# Altium project LifeLine.PrjPcb (part 2 of 2)

## Sheet AD8232.SchDoc
size A3; SheetNumber: 2; SheetTotal: 2
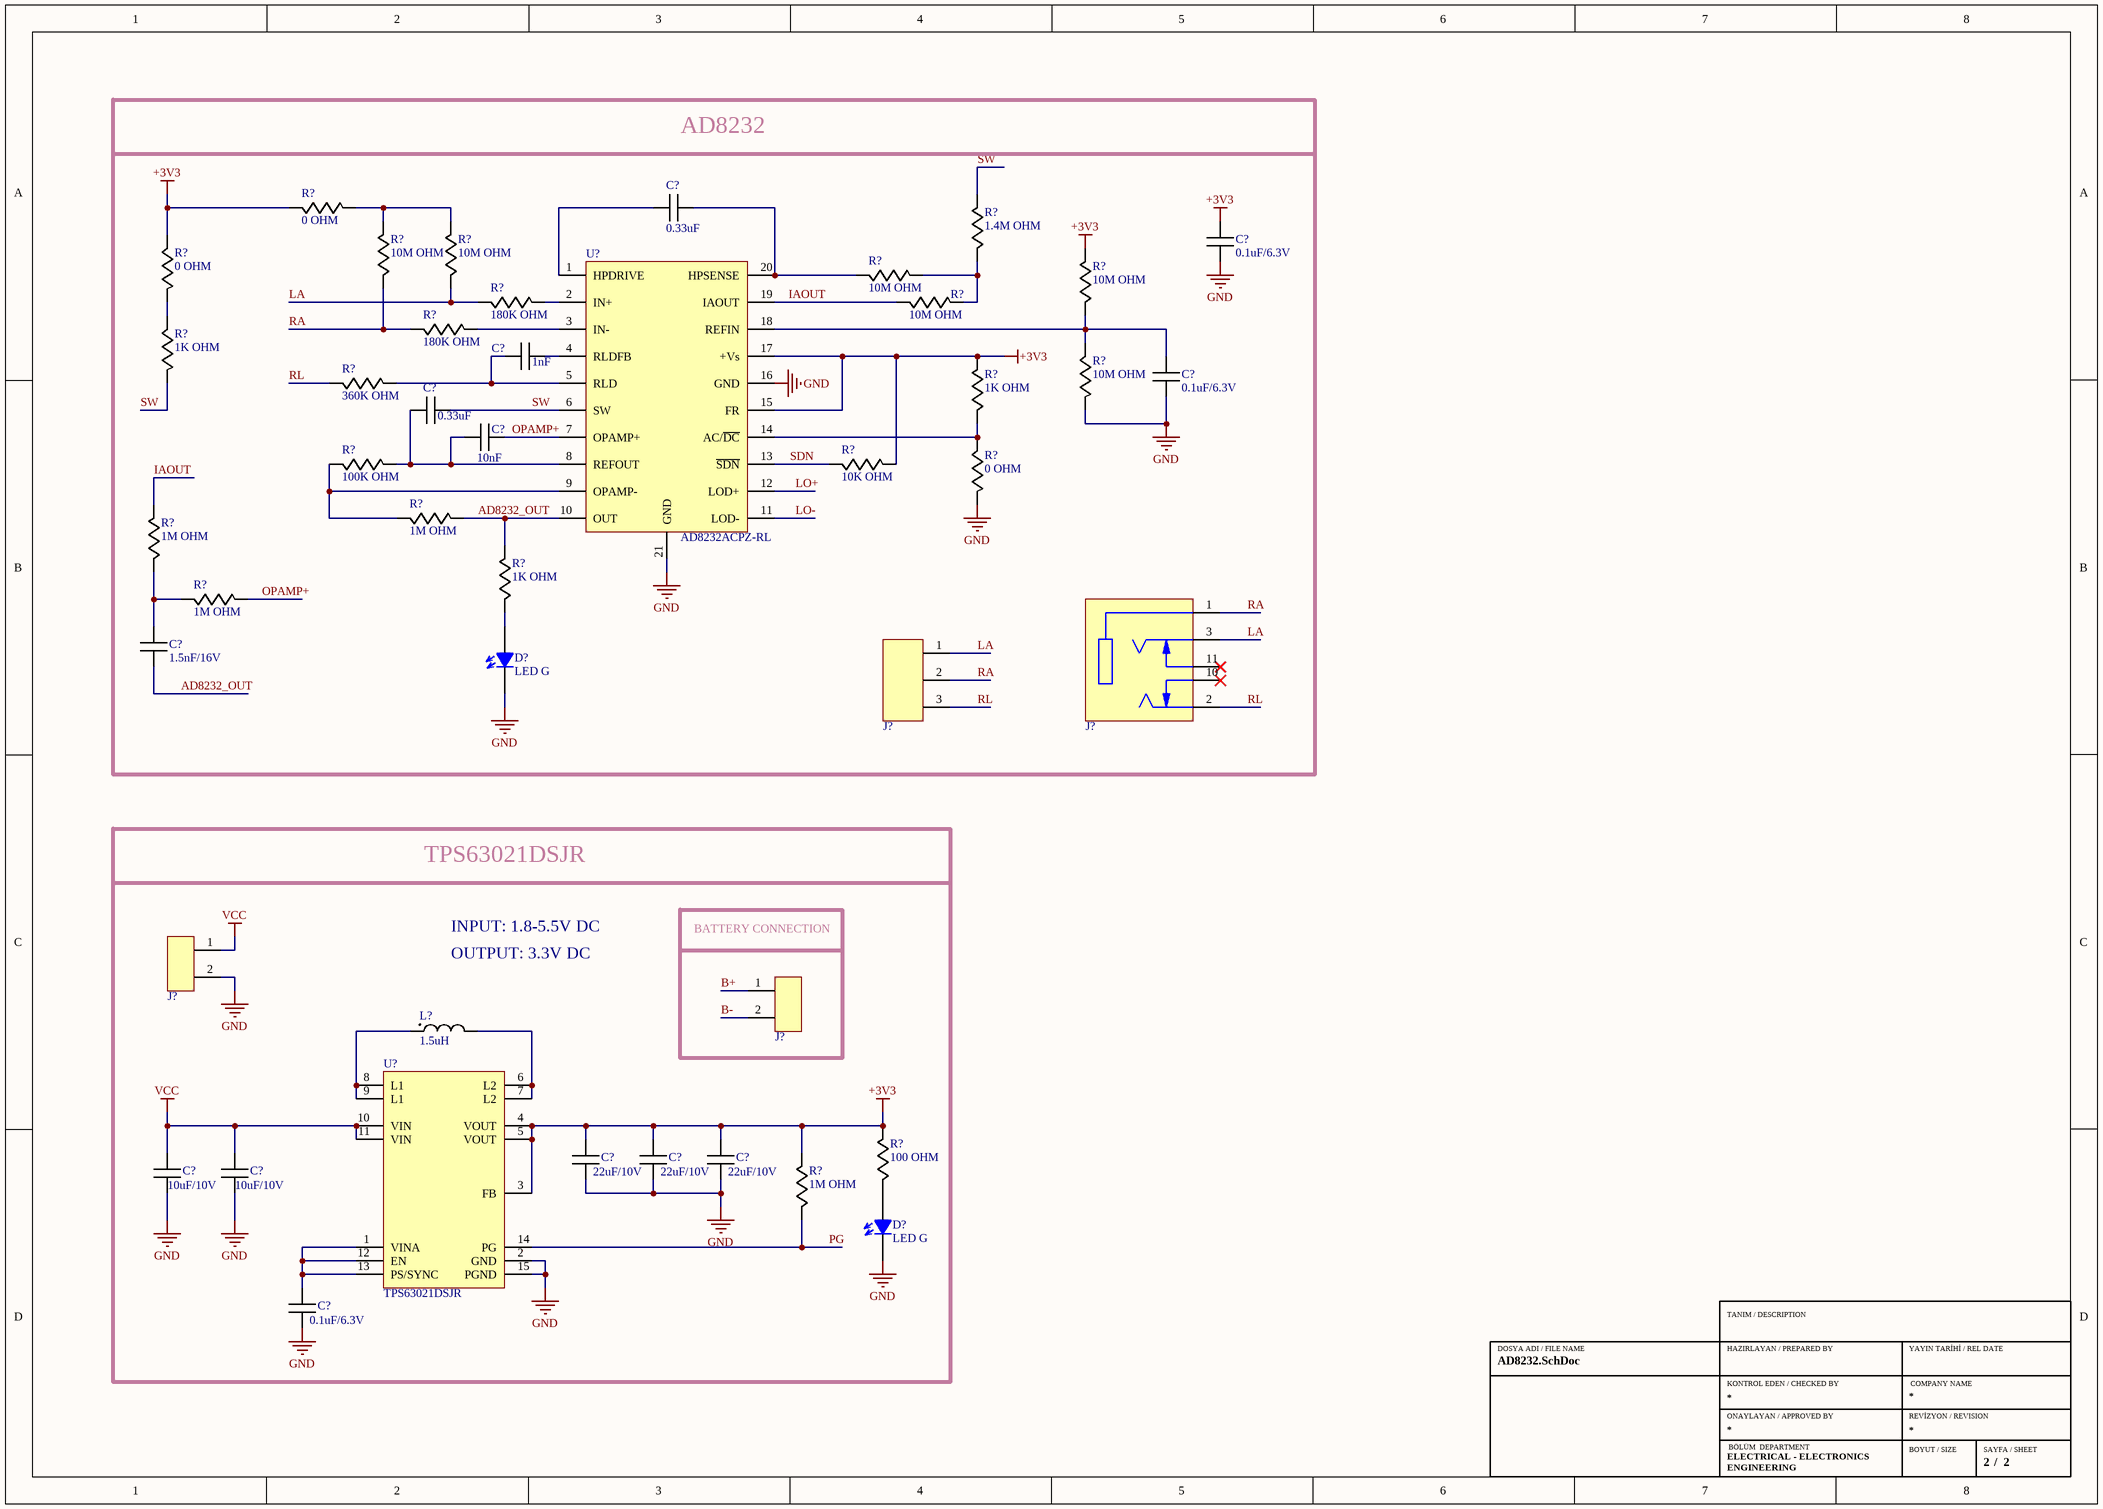
[diagram p1: AD8232.SchDoc]

### Parts
(Parts that share a designator on the sheet are numbered #1, #2 ... from top to bottom, then left to right.)
C?#17  0.33uF  [CAP_0603]
C?#18  0.1uF/6.3V  [CAP_0603]
C?#19  1nF  [CAP_0603]
C?#20  0.1uF/6.3V  [CAP_0603]
C?#21  0.33uF  [CAP_0603]
C?#22  10nF  [CAP_0603]
C?#23  1.5nF/16V  [CAP_0603]
C?#24  22uF/10V  [CAP_0603]
C?#25  22uF/10V  [CAP_0603]
C?#26  22uF/10V  [CAP_0603]
C?#27  10uF/10V  [CAP_0603]
C?#28  10uF/10V  [CAP_0603]
C?#29  0.1uF/6.3V  [CAP_0603]
D?#5  LED G  [LED_GREEN_0805]
D?#6  LED G  [LED_GREEN_0805]
J?#6  PPTC031LFBN-RC  [HEADER X3]  (value not drawn)
J?#7  AUDIO JACK, 3.5 MM, RT, 3 CONDUC  [SJ2-3593D]  (value not drawn)
J?#8  Header x2  [HEADER X2]  (value not drawn)
J?#9  BH-18650-PC  [1S BATTERY HOLDER]  (value not drawn)
L?  1.5uH  [IND_1616]
R?#15  0 OHM  [RES_0603]
R?#16  0 OHM  [RES_0603]
R?#17  1.4M OHM  [RES_0603]
R?#18  10M OHM  [RES_0603]
R?#19  10M OHM  [RES_0603]
R?#20  10M OHM  [RES_0603]
R?#21  180K OHM  [RES_0603]
R?#22  10M OHM  [RES_0603]
R?#23  1K OHM  [RES_0603]
R?#24  10M OHM  [RES_0603]
R?#25  180K OHM  [RES_0603]
R?#26  10M OHM  [RES_0603]
R?#27  360K OHM  [RES_0603]
R?#28  1K OHM  [RES_0603]
R?#29  0 OHM  [RES_0603]
R?#30  100K OHM  [RES_0603]
R?#31  10K OHM  [RES_0603]
R?#32  1M OHM  [RES_0603]
R?#33  1M OHM  [RES_0603]
R?#34  1M OHM  [RES_0603]
R?#35  1K OHM  [RES_0603]
R?#36  100 OHM  [RES 0805]
R?#37  1M OHM  [RES_0603]
U?#6  AD8232ACPZ-RL  [AD8232]
U?#7  TPS63021DSJR  [14-VFDFN]

### Blocks framed on the sheet
AD8232: C?#17-C?#23 D?#5 J?#6 J?#7 R?#15-R?#35 U?#6
TPS63021DSJR: C?#24-C?#29 D?#6 J?#8 L? R?#36 R?#37 U?#7
BATTERY CONNECTION: J?#9

### Nets
+3V3: C?#18.2 C?#24.2 C?#25.2 C?#26.2 R?#15.1 R?#16.1 R?#24.2 R?#28.2 R?#31.2 R?#36.2 R?#37.2 U?#6.15(FR) U?#6.17(+Vs) U?#7.3(FB) U?#7.4(VOUT) U?#7.5(VOUT)
GND: C?#18.1 C?#20.1 C?#24.1 C?#25.1 C?#26.1 C?#27.1 C?#28.1 C?#29.1 D?#5.1 D?#6.1 J?#8.2 R?#26.2 R?#29.2 U?#6.16(GND) U?#6.21(GND) U?#7.2(GND) U?#7.15(PGND)
VCC: C?#27.2 C?#28.2 J?#8.1 U?#7.10(VIN) U?#7.11(VIN)
AD8232_OUT: C?#23.1 R?#32.2 R?#35.2 U?#6.10(OUT)
B+: J?#9.1
B-: J?#9.2
IAOUT: R?#22.1 R?#33.2 U?#6.19(IAOUT)
LA: J?#6.1 J?#7.3(RING) R?#20.1 R?#21.1
LO+: U?#6.12(LOD+)
LO-: U?#6.11(LOD-)
OPAMP+: C?#22.2 R?#34.2 U?#6.7(OPAMP+)
PG: R?#37.1 U?#7.14(PG)
RA: J?#6.2 J?#7.1(SLEEVE) R?#19.1 R?#25.1
RL: J?#6.3 J?#7.2(TIP) R?#27.1
SDN: R?#31.1 U?#6.13(~{SDN})
SW: C?#21.2 R?#17.2 R?#23.2 U?#6.6(SW)
NetC?#17_1: C?#17.1 U?#6.1(HPDRIVE)
NetC?#17_2: C?#17.2 R?#18.1 U?#6.20(HPSENSE)
NetC?#19_1: C?#19.1 U?#6.4(RLDFB)
NetC?#19_2: C?#19.2 R?#27.2 U?#6.5(RLD)
NetC?#20_2: C?#20.2 R?#24.1 R?#26.1 U?#6.18(REFIN)
NetC?#21_1: C?#21.1 C?#22.1 R?#30.2 U?#6.8(REFOUT)
NetC?#23_2: C?#23.2 R?#33.1 R?#34.1
NetC?#29_2: C?#29.2 U?#7.1(VINA) U?#7.12(EN) U?#7.13(PS/SYNC)
NetD?#5_2: D?#5.2 R?#35.1
NetD?#6_2: D?#6.2 R?#36.1
NetL?_1: L?.1 U?#7.8(L1) U?#7.9(L1)
NetL?_2: L?.2 U?#7.6(L2) U?#7.7(L2)
NetR?#15_2: R?#15.2 R?#19.2 R?#20.2
NetR?#16_2: R?#16.2 R?#23.1
NetR?#17_1: R?#17.1 R?#18.2 R?#22.2
NetR?#21_2: R?#21.2 U?#6.2(IN+)
NetR?#25_2: R?#25.2 U?#6.3(IN-)
NetR?#28_1: R?#28.1 R?#29.1 U?#6.14(AC/~{DC})
NetR?#30_1: R?#30.1 R?#32.1 U?#6.9(OPAMP-)

Not connected (* = marked no-connect by the designer): J?#7 10(TIP_SWITCH)* 11(RING_SWITCH1)*

### Notes on the sheet
- INPUT: 1.8-5.5V DC
- OUTPUT: 3.3V DC
- TANIM / DESCRIPTION
- DOSYA ADI / FILE NAME
- HAZIRLAYAN / PREPARED BY
- KONTROL EDEN / CHECKED BY
- YAYIN TARİHİ / REL DATE
- COMPANY NAME
- ONAYLAYAN / APPROVED BY
- ELECTRICAL - ELECTRONICS
- BÖLÜM  DEPARTMENT
- BOYUT / SIZE
- REVİZYON / REVISION
- SAYFA / SHEET
- ENGINEERING
- /

### Library data of the parts
C?#17 C?#21 = CAP CER 0.33uF 0603 - L: Res Thick Film 0603 1M Ohm 5% 1/10W ±200ppm/°C Molded SMD SMD Paper T/R; Manufacturer: Vishay Dale; Manufacturer Part Number: CRCW06031M00JNEA; Resistance: 1MR; Power Rating: 100mW; Voltage Rating: 75V; Supplier 1: Arrow Electronics; RoHS: Yes; Category: Chip SMD Resistors; Stock 1: 960000; Pricing 1: 5000=0,0028 (USD); Case/Package: 0603; Number of Pins: 2; Weight: 7.1E-05oz; Case Code (Imperial): 0603; Case Code (Metric): 1608; Contact Plating: Tin; Size Code: 0603; Min Operating Temperature: -55°C; Max Operating Temperature: 155°C; Tolerance: 5%; Packaging: Tape and Reel; Package Quantity: 5000; Termination: SMD/SMT; Resistor Type: Thick Film; Number of Terminations: 2; Temperature Coefficient: 200ppm/°C; Max Power Dissipation: 100mW; Features: Automotive AEC-Q200; Series: CRCW; Construction: Rectangular; Resistance Tolerance: 5%; Length: 1.55mm; Width: 0.85mm; Height: 0.45mm; Depth: 0.85mm; Ratings: AEC-Q200; Radiation Hardening: No; Lead Free: 5697LeadFree; Military Standard: Not; RoHS Compliant: Yes; Reach SVHC Compliant: Unknown; ComponentLink1URL: https://datasheet.ciiva.com/2462/dcrcwe3-2462062.pdf?src-supplier=Digikey; ComponentLink1Description: https://datasheet.ciiva.com/2462/dcrcwe3-2462062.pdf?src-supplier=Digikey; ComponentLink2URL: https://datasheet.ciiva.com/2462/dcrcwe3-2462063.pdf?src-supplier=Digikey; ComponentLink2Description: https://datasheet.ciiva.com/2462/dcrcwe3-2462063.pdf?src-supplier=Digikey; ComponentLink3URL: https://datasheet.ciiva.com/2462/dcrcwe3-2462061.pdf?src-supplier=Digikey; ComponentLink3Description: https://datasheet.ciiva.com/2462/dcrcwe3-2462061.pdf?src-supplier=Digikey; ComponentLink4URL: https://datasheet.ciiva.com/3257/dcrcwe3-3257206.pdf?src-supplier=Avnet; ComponentLink4Description: https://datasheet.ciiva.com/3257/dcrcwe3-3257206.pdf?src-supplier=Avnet; ComponentLink5URL: https://datasheet.ciiva.com/16351/dcrcwe3-16351110.pdf?src-supplier=Future+Electronics; ComponentLink5Description: https://datasheet.ciiva.com/16351/dcrcwe3-16351110.pdf?src-supplier=Future+Electronics; Supplier Part Number 1: CRCW06031M00JNEA
C?#18 C?#20 = CAP CER 0.1uF 0603 - L: Capacitor, Ceramic, 100Nf, 6.3Vdc, 10-% Tol, 10+% Tol, X7r-Tc Code, -15, 15%-Tc Rohs Compliant: Yes; Manufacturer: KEMET; Manufacturer Part Number: C0603C104K9RACTU; Dielectric Material: 4241ConductorMaterial; Voltage Rating: 6.3V; Tolerance: 10%; Dielectric: X7R; Dissipation Factor: 5%; Supplier 1: Digikey; RoHS: Yes; Category: Ceramic Capacitors; Stock 1: 82215; Pricing 1: 1=0,11, 10=0,066, 100=0,0429, 1000=0,0305 (USD); Mount: Surface Mount; Case/Package: 0603; Case Code (Imperial): 0603; Case Code (Metric): 1608; Material: 4241ConductorMaterial; Min Operating Temperature: -55°C; Max Operating Temperature: 125°C; Capacitance: 100nF; Package Quantity: 4000; Packaging: Tape and Reel; Voltage Rating (DC): 6.3V; Termination: SMD/SMT; Series: C; Construction: Flat; Length: 1.6mm; Width: 0.8mm; Height: 0.8mm; Thickness: 0.034inch; Depth: 0.8mm; Radiation Hardening: No; RoHS Compliant: Yes; ComponentLink1URL: https://datasheet.ciiva.com/13371/kem-c1002-x7r-smd-357932-13371879.pdf?src-supplier=Mouser; ComponentLink1Description: https://datasheet.ciiva.com/13371/kem-c1002-x7r-smd-357932-13371879.pdf?src-supplier=Mouser; Supplier Part Number 1: 399-15351-1-ND
C?#19 = CAP CER 1nF 0603 - L: Cap Ceramic 0.001uF 16V X7R 10% Pad SMD 0603 Flexible Termination 125°C Automotive Medical T/R; Manufacturer: KEMET; Manufacturer Part Number: C0603X102K4RACAUTO; Dielectric Material: 4241ConductorMaterial; Dielectric: 1511DielectricType; Supplier 1: Mouser; RoHS: Yes; Category: Ceramic Capacitors; Stock 1: 6058; Pricing 1: 1=0,35, 10=0,21, 50=0,21, 100=0,138, 1000=0,1, 10000=0,073 (USD); Case/Package: 345Case; Capacitance: 1nF; Voltage Rating (DC): 16V; Supplier Part Number 1: 80-C0603X102K4RAUTO
C?#22 = CAP CER 10nF 0603 - L: Cap Ceramic 0.01uF 100V X7R 10% Pad SMD 0603 Flexible Termination 125°C Automotive Medical T/R; Manufacturer: KEMET; Manufacturer Part Number: C0603X103K1RACAUTO7411; Dielectric Material: 4241ConductorMaterial; Dielectric: 1511DielectricType; Supplier 1: Farnell; RoHS: Yes; Category: Capacitors; Pricing 1: 15000=0,071 (EUR); Case/Package: 345Case; Capacitance: 10nF; Voltage Rating (DC): 100V; Supplier Part Number 1: 4256824
C?#23 = CAP CER 1.5nF 0603 - L: Surface Mount Ceramic Multilayer Capacitor 0.0015uF 10% X7R 16V 0603 Paper T/R; Manufacturer: Yageo; Manufacturer Part Number: CC0603KRX7R7BB152; Material: 4241ConductorMaterial; Supplier 1: Mouser; RoHS: Yes; Category: Ceramic Capacitors; Stock 1: 19885; Pricing 1: 1=0,1, 10=0,029, 50=0,029, 100=0,017, 1000=0,011, 10000=0,007 (USD); ComponentLink1URL: https://datasheet.ciiva.com/13265/upy-gphc-x7r-6-3v-to-50v-8-12304-13265065.pdf?src-supplier=Mouser; ComponentLink1Description: https://datasheet.ciiva.com/13265/upy-gphc-x7r-6-3v-to-50v-8-12304-13265065.pdf?src-supplier=Mouser; Supplier Part Number 1: 603-CC603KRX7R7BB152
C?#24-C?#26 = CAP CER 22uF: Multilayer Ceramic Capacitor, 22 uF, 10 V, ï¿½ 20%, X5R, 0603 [1608 Metric]; Manufacturer: Murata; Manufacturer Part Number: GRM188R61A226ME15D; Capacitance: 22uF; Voltage Rating: 10V; Supplier 1: Digikey; RoHS: Yes; Category: Ceramic Capacitors; Stock 1: 1055825; Pricing 1: 1=0,17, 10=0,107, 100=0,056, 1000=0,0376 (USD); Mount: Surface Mount; Case/Package: 0603; Case Code (Metric): 1608; Case Code (Imperial): 0603; Material: Ceramic; Weight: 0.000222oz; Min Operating Temperature: -55°C; Max Operating Temperature: 85°C; Tolerance: 20%; Packaging: Cut Tape; Dielectric: X5R; Termination: SMD/SMT; Voltage Rating (DC): 10V; Package Quantity: 4000; Series: GRM; Length: 1.6mm; Width: 0.8mm; Height: 0.8mm; Thickness: 0.039inch; Reach SVHC Compliant: No; RoHS Compliant: Yes; Lead Free: 5697LeadFree; ComponentLink1URL: https://datasheet.ciiva.com/46444/1769893-46444975.pdf?src-supplier=Element14; ComponentLink1Description: https://datasheet.ciiva.com/46444/1769893-46444975.pdf?src-supplier=Element14; Supplier Part Number 1: 490-10476-1-ND
C?#27 C?#28 = CAP CER 10uF: Multilayer Ceramic Capacitor, 10 uF, 10 V, ï¿½ 20%, X5R, 0603 [1608 Metric]; Manufacturer: Murata; Manufacturer Part Number: GRM188R61A106ME69D; Capacitance: 10uF; Voltage Rating: 10V; Supplier 1: Digikey; RoHS: Yes; Category: Ceramic Capacitors; Stock 1: 92548; Pricing 1: 1=0,12, 10=0,068, 100=0,0409, 1000=0,02707 (USD); Mount: Surface Mount; Case/Package: 0603; Number of Pins: 2NUMBER; Case Code (Metric): 1608; Case Code (Imperial): 0603; Material: Ceramic; Weight: 0.000222oz; Min Operating Temperature: -55°C; Max Operating Temperature: 85°C; Packaging: Tape and Reel; Tolerance: 20%; Dielectric: X5R; Termination: SMD/SMT; Voltage Rating (DC): 10V; Package Quantity: 4000; Series: GRM; Length: 1.6mm; Width: 0.8mm; Height: 0.8mm; Thickness: 0.035inch; Lead Free: Lead Free; RoHS Compliant: Yes; Reach SVHC Compliant: Unknown; ComponentLink1URL: http://www.farnell.com/datasheets/1872210.pdf?src-supplier=Farnell; ComponentLink1Description: http://www.farnell.com/datasheets/1872210.pdf?src-supplier=Farnell; ComponentLink2URL: http://www.mouser.com/ds/2/281/c02e-2905.pdf?src-supplier=Mouser; ComponentLink2Description: http://www.mouser.com/ds/2/281/c02e-2905.pdf?src-supplier=Mouser; ComponentLink3URL: http://www.farnell.com/datasheets/1872210.pdf?src-supplier=Newark; ComponentLink3Description: http://www.farnell.com/datasheets/1872210.pdf?src-supplier=Newark; ComponentLink4URL: https://datasheet.octopart.com/GRM188R61A106ME69D-Murata-datasheet-22122223.pdf?src-supplier=Future+Electronics; ComponentLink4Description: https://datasheet.octopart.com/GRM188R61A106ME69D-Murata-datasheet-22122223.pdf?src-supplier=Future+Electronics; ComponentLink5URL: http://search.murata.co.jp/Ceramy/image/img/A01X/G101/ENG/GRM188R61A106ME69-01.pdf?src-supplier=Digikey; ComponentLink5Description: http://search.murata.co.jp/Ceramy/image/img/A01X/G101/ENG/GRM188R61A106ME69-01.pdf?src-supplier=Digikey; ComponentLink6URL: http://www.farnell.com/datasheets/2048014.pdf?src-supplier=Element14; ComponentLink6Description: http://www.farnell.com/datasheets/2048014.pdf?src-supplier=Element14; ComponentLink7URL: https://datasheet.octopart.com/GRM188R61A106ME69D-Murata-datasheet-62317187.pdf?src-supplier=Element14; ComponentLink7Description: https://datasheet.octopart.com/GRM188R61A106ME69D-Murata-datasheet-62317187.pdf?src-supplier=Element14; ComponentLink8URL: http://www.farnell.com/datasheets/1872210.pdf?src-supplier=Element14; ComponentLink8Description: http://www.farnell.com/datasheets/1872210.pdf?src-supplier=Element14; ComponentLink9URL: https://datasheet.octopart.com/GRM188R61A106ME69D-Murata-datasheet-165579666.pdf?src-supplier=TME; ComponentLink9Description: https://datasheet.octopart.com/GRM188R61A106ME69D-Murata-datasheet-165579666.pdf?src-supplier=TME; Supplier Part Number 1: 490-10475-1-ND
C?#29 = CAP CER 0.1uF: Capacitor, Ceramic, 100Nf, 6.3Vdc, 10-% Tol, 10+% Tol, X7r-Tc Code, -15, 15%-Tc Rohs Compliant: Yes; Manufacturer: KEMET; Manufacturer Part Number: C0603C104K9RACTU; Dielectric Material: 4241ConductorMaterial; Voltage Rating: 6.3V; Tolerance: 10%; Dielectric: X7R; Dissipation Factor: 5%; Supplier 1: Digikey; RoHS: Yes; Category: Ceramic Capacitors; Stock 1: 82215; Pricing 1: 1=0,11, 10=0,066, 100=0,0429, 1000=0,0305 (USD); Mount: Surface Mount; Case/Package: 0603; Case Code (Imperial): 0603; Case Code (Metric): 1608; Material: 4241ConductorMaterial; Min Operating Temperature: -55°C; Max Operating Temperature: 125°C; Capacitance: 100nF; Package Quantity: 4000; Packaging: Tape and Reel; Voltage Rating (DC): 6.3V; Termination: SMD/SMT; Series: C; Construction: Flat; Length: 1.6mm; Width: 0.8mm; Height: 0.8mm; Thickness: 0.034inch; Depth: 0.8mm; Radiation Hardening: No; RoHS Compliant: Yes; ComponentLink1URL: https://datasheet.ciiva.com/13371/kem-c1002-x7r-smd-357932-13371879.pdf?src-supplier=Mouser; ComponentLink1Description: https://datasheet.ciiva.com/13371/kem-c1002-x7r-smd-357932-13371879.pdf?src-supplier=Mouser; Supplier Part Number 1: 399-15351-1-ND
D?#5 D?#6 = LED GREEN 0805: XL-2012SYGC / Green 570nm LED Indication - Discrete 2.1V 0805 (2012 Metric)
J?#6 = HEADER x3 - L: Female, 3C, Straight, .100"CC; 3.20mm Tail, No Mt. 100u" Tin; PBT, Phos Bronze, 105 C; Manufacturer: Sullins; Supplier 1: Future Electronics; Manufacturer Part Number: PPTC031LFBN-RC; RoHS: Yes; Category: Connectors; Pricing 1: 1000=0,179, 2000=0,176, 3000=0,175, 5000=0,173, 10000=0,17 (USD); ComponentLink1URL: https://media.digikey.com/pdf/Data%20Sheets/Sullins%20PDFs/Female_Headers.100_DS.pdf?src-supplier=Digikey; ComponentLink1Description: https://media.digikey.com/pdf/Data%20Sheets/Sullins%20PDFs/Female_Headers.100_DS.pdf?src-supplier=Digikey; ComponentLink2URL: https://datasheet.octopart.com/PPTC031LFBN-RC-Sullins-datasheet-41308905.pdf?src-supplier=Future+Electronics; ComponentLink2Description: https://datasheet.octopart.com/PPTC031LFBN-RC-Sullins-datasheet-41308905.pdf?src-supplier=Future+Electronics; ComponentLink3URL: http://www.sullinscorp.com/catalogs/78_Page80-81_HEADER_.100_2.54mm_FEMALE.pdf?src-supplier=Future+Electronics; ComponentLink3Description: http://www.sullinscorp.com/catalogs/78_Page80-81_HEADER_.100_2.54mm_FEMALE.pdf?src-supplier=Future+Electronics; Supplier Part Number 1: 2482834
J?#7 = SJ2-3593D: 3.5 mm, Stereo, Right Angle, Surface Mount (SMT), Audio Jack Connector; Manufacturer: Same Sky; Manufacturer Part Number: SJ2-3593D-SMT-TR; Body Color: Black; Gender: Female; Shielding: Unshielded; Current Rating: 1A; Number of Conductors: 3; Voltage Rating: 12V; Supplier 1: Mouser; RoHS: Yes; Category: Audio / Video Connectors; Stock 1: 1143; Pricing 1: 1=1,16, 10=0,985, 50=0,879, 100=0,837, 1000=0,73, 10000=0,644 (USD); Mount: Surface Mount; Contact Plating: Silver; Contact Material: Brass; Housing Material: Nylon; Min Operating Temperature: -25°C; Max Operating Temperature: 85°C; Series: SJ2; Termination: Solder; ComponentLink1URL: https://www.cuidevices.com/product/resource/digikeypdf/sj2-359x-smt.pdf?src-supplier=Digikey; ComponentLink1Description: https://www.cuidevices.com/product/resource/digikeypdf/sj2-359x-smt.pdf?src-supplier=Digikey; ComponentLink2URL: https://datasheet.octopart.com/SJ2-3593D-SMT-TR-CUI-Devices-datasheet-175926068.pdf?src-supplier=Electro+Sonic; ComponentLink2Description: https://datasheet.octopart.com/SJ2-3593D-SMT-TR-CUI-Devices-datasheet-175926068.pdf?src-supplier=Electro+Sonic; ComponentLink3URL: https://datasheet.octopart.com/SJ2-3593D-SMT-TR-CUI-Devices-datasheet-140598664.pdf?src-supplier=Master+Electronics; ComponentLink3Description: https://datasheet.octopart.com/SJ2-3593D-SMT-TR-CUI-Devices-datasheet-140598664.pdf?src-supplier=Master+Electronics; Supplier Part Number 1: 490-SJ2-3593D-SMT-TR
J?#9 = 1S BATTERY HOLDER: Battery Holder (Open) 18650 1 Cell PC Pin; ComponentLink1Description: purchasing; ComponentLink1URL: https://www.digikey.com/en/products/detail/mpd-memory-protection-devices/BH-18650-PC/3029216
L? = IND 1.5uH: Inductor Power Shielded Wirewound 1.5uH 20% 100KHz 9.1A 15.8mOhm DCR 1515 Automotive Embossed Plastic T/R; Manufacturer: Coilcraft; Manufacturer Part Number: XFL4020-152MEC; Series Resistance: 15.8mR; Supplier 1: Mouser; RoHS: Yes; Category: Fixed Inductors; Stock 1: 11355; Pricing 1: 1=2,68, 10=2,68, 50=2,68, 100=2,68, 1000=1,01, 10000=1,01 (USD); ComponentLink1URL: https://datasheet.ciiva.com/13168/xfl4020-13168080.pdf?src-supplier=Mouser; ComponentLink1Description: https://datasheet.ciiva.com/13168/xfl4020-13168080.pdf?src-supplier=Mouser; ComponentLink2URL: https://datasheet.ciiva.com/22679/1682010-22679275.pdf?src-supplier=Element14; ComponentLink2Description: https://datasheet.ciiva.com/22679/1682010-22679275.pdf?src-supplier=Element14; ComponentLink3URL: https://datasheet.ciiva.com/22679/1682010-22679276.pdf?src-supplier=Element14; ComponentLink3Description: https://datasheet.ciiva.com/22679/1682010-22679276.pdf?src-supplier=Element14; Supplier Part Number 1: 994-XFL4020-152MEC
R?#15 R?#16 R?#29 = RES 0 OHM 0603 - L: Zero Ohm Resistor, Jumper, 0603 [1608 Metric], Thick Film, 100 mW, 2 A, Surface Mount Device; Manufacturer: Vishay Semiconductors; Manufacturer Part Number: RCA06030000ZSEA; Voltage Rating (DC): 75V; Temperature Coefficient: 100ppm/°C; Supplier 1: Arrow Electronics; RoHS: Yes; Category: Chip SMD Resistors; Stock 1: 1488; Pricing 1: 1=0,0364, 10=0,0107, 25=0,0106, 100=0,0105, 250=0,0104, 500=0,0103 (USD); Lead Free: 5697LeadFree; ComponentLink1URL: https://datasheet.ciiva.com/8901/rcae3-8901867.pdf?src-supplier=Avnet; ComponentLink1Description: https://datasheet.ciiva.com/8901/rcae3-8901867.pdf?src-supplier=Avnet; ComponentLink2URL: https://datasheet.ciiva.com/16480/rcae3-16480902.pdf?src-supplier=Future+Electronics; ComponentLink2Description: https://datasheet.ciiva.com/16480/rcae3-16480902.pdf?src-supplier=Future+Electronics; Supplier Part Number 1: RCA06030000ZSEA
R?#17 = RES 1.4M OHM 0603 - L: Res Thick Film 0603 1.4M Ohm 1% 0.1W(1/10W) ±100ppm/C Pad SMD T/R Automotive AEC-Q200; Manufacturer: Vishay; Manufacturer Part Number: CRCW06031M40FKEA; Voltage Rating (DC): 75V; Supplier 1: Mouser; RoHS: Yes; Category: Chip SMD Resistors; Stock 1: 16256; Pricing 1: 1=0,1, 10=0,028, 50=0,028, 100=0,015, 1000=0,008, 10000=0,004 (USD); Lead Free: 5697LeadFree; ComponentLink1URL: https://datasheet.ciiva.com/16785/70201119-16785253.pdf?src-supplier=Allied+Electronics; ComponentLink1Description: https://datasheet.ciiva.com/16785/70201119-16785253.pdf?src-supplier=Allied+Electronics; ComponentLink2URL: https://datasheet.ciiva.com/16215/dcrcwe3-16215401.pdf?src-supplier=Future+Electronics; ComponentLink2Description: https://datasheet.ciiva.com/16215/dcrcwe3-16215401.pdf?src-supplier=Future+Electronics; ComponentLink3URL: https://datasheet.ciiva.com/22702/1697337-22702714.pdf?src-supplier=Element14; ComponentLink3Description: https://datasheet.ciiva.com/22702/1697337-22702714.pdf?src-supplier=Element14; ComponentLink4URL: https://datasheet.ciiva.com/22870/70201119-22870815.pdf?src-supplier=Allied+Electronics; ComponentLink4Description: https://datasheet.ciiva.com/22870/70201119-22870815.pdf?src-supplier=Allied+Electronics; ComponentLink5URL: https://datasheet.ciiva.com/5541/dcrcwe3-109170-5541158.pdf?src-supplier=Mouser; ComponentLink5Description: https://datasheet.ciiva.com/5541/dcrcwe3-109170-5541158.pdf?src-supplier=Mouser; ComponentLink6URL: https://datasheet.ciiva.com/2466/dcrcwe3-2466344.pdf?src-supplier=Digikey; ComponentLink6Description: https://datasheet.ciiva.com/2466/dcrcwe3-2466344.pdf?src-supplier=Digikey; ComponentLink7URL: https://datasheet.ciiva.com/2466/dcrcwe3-2466345.pdf?src-supplier=Digikey; ComponentLink7Description: https://datasheet.ciiva.com/2466/dcrcwe3-2466345.pdf?src-supplier=Digikey; ComponentLink8URL: https://datasheet.ciiva.com/2466/dcrcwe3-2466346.pdf?src-supplier=Digikey; ComponentLink8Description: https://datasheet.ciiva.com/2466/dcrcwe3-2466346.pdf?src-supplier=Digikey; ComponentLink9URL: https://datasheet.ciiva.com/9102/dcrcwe3-9102326.pdf?src-supplier=Avnet; ComponentLink9Description: https://datasheet.ciiva.com/9102/dcrcwe3-9102326.pdf?src-supplier=Avnet; ComponentLink10URL: https://datasheet.ciiva.com/7670/1697337-7670542.pdf?src-supplier=Element14; ComponentLink10Description: https://datasheet.ciiva.com/7670/1697337-7670542.pdf?src-supplier=Element14; ComponentLink11URL: https://datasheet.ciiva.com/7670/1697337-7670543.pdf?src-supplier=Element14; ComponentLink11Description: https://datasheet.ciiva.com/7670/1697337-7670543.pdf?src-supplier=Element14; Supplier Part Number 1: 71-CRCW06031M40FKEA
R?#18-R?#20 R?#22 R?#24 R?#26 = RES 10M OHM 0603 - L: SMD Chip Resistor, 10 MOhm, ± 5%, 250 mW, 0603 [1608 Metric], Thick Film, Anti-Surge; Manufacturer: Vishay Dale; Manufacturer Part Number: RCS060310M0JNEA; Resistance: 10MR; Max Power Dissipation: 250mW; Temperature Coefficient: 200ppm/°C; Supplier 1: Mouser; RoHS: Yes; Category: Chip SMD Resistors; Stock 1: 7358; Pricing 1: 1=0,14, 10=0,044, 50=0,044, 100=0,038, 1000=0,024, 10000=0,015 (USD); Case/Package: 0603; Case Code (Metric): 1608; Case Code (Imperial): 0603; Min Operating Temperature: -55°C; Max Operating Temperature: 155°C; Packaging: Cut Tape; Number of Terminations: 2; Tolerance: 5%; Features: Automotive AEC-Q200; Series: RCS; Length: 0.061inch; Width: 0.033inch; Height: 0.02inch; Ratings: AEC-Q200; ComponentLink1URL: http://www.vishay.com/docs/20065/rcse3.pdf?src-supplier=Digikey; ComponentLink1Description: http://www.vishay.com/docs/20065/rcse3.pdf?src-supplier=Digikey; Supplier Part Number 1: 71-RCS060310M0JNEA
R?#21 R?#25 = RES 180K OHM 0603 - L: Thick Film Resistors 1/10watt 180Kohms 5%; Manufacturer: KOA Speer; Manufacturer Part Number: RK73B1JTTD184J; Resistance: 180kR; Power Rating: 100mW; Voltage Rating: 50V; Temperature Coefficient: 200ppm/°C; Supplier 1: Mouser; RoHS: Yes; Category: Chip SMD Resistors; Stock 1: 68862; Pricing 1: 1=0,1, 10=0,011, 50=0,011, 100=0,009, 1000=0,005, 10000=0,002 (USD); Case/Package: 0603; Number of Pins: 2; Case Code (Imperial): 0603; Case Code (Metric): 1608; Min Operating Temperature: -55°C; Max Operating Temperature: 155°C; Tolerance: 5%; Packaging: Tape and Reel; Package Quantity: 5000; Resistor Type: Thick Film; Termination: SMD/SMT; Voltage Rating (DC): 50V; Series: RK73B; Construction: Rectangular; Technology: THICK FILM; Resistance Tolerance: 5%; Length: 1.6mm; Width: 0.8mm; Height: 0.45mm; Depth: 0.8mm; Military Standard: Not; Lead Free: Lead Free; RoHS Compliant: Yes; ComponentLink1URL: https://datasheet.ciiva.com/26893/getdatasheetpartid-447064-26893322.pdf?src-supplier=Verical; ComponentLink1Description: https://datasheet.ciiva.com/26893/getdatasheetpartid-447064-26893322.pdf?src-supplier=Verical; ComponentLink2URL: https://datasheet.ciiva.com/7763/548635-7763053.pdf?src-supplier=Element14; ComponentLink2Description: https://datasheet.ciiva.com/7763/548635-7763053.pdf?src-supplier=Element14; Supplier Part Number 1: 660-RK73B1JTTD184J
R?#23 R?#28 R?#35 = RES 1K OHM 0603 - L: Res Thick Film 0603 1K Ohm 5% 0.25W(1/4W) ±200ppm/°C Pad SMD T/R Automotive AEC-Q200; Manufacturer: Rohm; Manufacturer Part Number: ESR03EZPJ102; Resistance: 1kR; Max Power Dissipation: 250mW; Voltage Rating: 150V; Supplier 1: Mouser; RoHS: Yes; Category: Chip SMD Resistors; Stock 1: 16160; Pricing 1: 1=0,14, 10=0,043, 50=0,043, 100=0,037, 1000=0,023, 10000=0,015 (USD); Case/Package: 0603; Case Code (Metric): 1608; Case Code (Imperial): 0603; Min Operating Temperature: -55°C; Max Operating Temperature: 155°C; Tolerance: 5%; Packaging: Cut Tape; Number of Terminations: 2; Temperature Coefficient: 200ppm/°C; Features: Automotive AEC-Q200; Series: ESR; Voltage Rating (DC): 150V; Ratings: AEC-Q200; Lead Free: Lead Free; RoHS Compliant: Yes; ComponentLink1URL: https://datasheet.ciiva.com/2469/esr-2469604.pdf?src-supplier=Digikey; ComponentLink1Description: https://datasheet.ciiva.com/2469/esr-2469604.pdf?src-supplier=Digikey; ComponentLink2URL: https://datasheet.ciiva.com/2469/esr-2469605.pdf?src-supplier=Digikey; ComponentLink2Description: https://datasheet.ciiva.com/2469/esr-2469605.pdf?src-supplier=Digikey; ComponentLink3URL: https://datasheet.ciiva.com/2469/esr-2469603.pdf?src-supplier=Digikey; ComponentLink3Description: https://datasheet.ciiva.com/2469/esr-2469603.pdf?src-supplier=Digikey; Supplier Part Number 1: 755-ESR03EZPJ102
R?#27 = RES 360K OHM 0603 - L: Res Thick Film 0603 360K Ohm 1% 0.1W(1/10W) ±100ppm/C Pad SMD T/R; Manufacturer: Yageo; Manufacturer Part Number: RC0603FR-07360KL; Voltage Rating (DC): 50V; Supplier 1: Future Electronics; RoHS: Yes; Category: Chip SMD Resistors; Stock 1: 145000; Pricing 1: 5000=0,0009, 50000=0,0009, 150000=0,0009, 625000=0,0008, 1500000=0,0008 (USD); Lead Free: 5697LeadFree; ComponentLink1URL: https://datasheet.ciiva.com/11809/0900766b80c66297-11809321.pdf?src-supplier=Rs; ComponentLink1Description: https://datasheet.ciiva.com/11809/0900766b80c66297-11809321.pdf?src-supplier=Rs; ComponentLink2URL: https://datasheet.ciiva.com/12557/rc0603-272842-12557861.pdf?src-supplier=Mouser; ComponentLink2Description: https://datasheet.ciiva.com/12557/rc0603-272842-12557861.pdf?src-supplier=Mouser; ComponentLink3URL: https://datasheet.ciiva.com/2454/pyu-r-int-thick-7-2454222.pdf?src-supplier=Digikey; ComponentLink3Description: https://datasheet.ciiva.com/2454/pyu-r-int-thick-7-2454222.pdf?src-supplier=Digikey; ComponentLink4URL: https://datasheet.ciiva.com/2454/pyu-r-int-thick-7-2454223.pdf?src-supplier=Digikey; ComponentLink4Description: https://datasheet.ciiva.com/2454/pyu-r-int-thick-7-2454223.pdf?src-supplier=Digikey; ComponentLink5URL: https://datasheet.ciiva.com/2454/pyu-r-int-thick-7-2454224.pdf?src-supplier=Digikey; ComponentLink5Description: https://datasheet.ciiva.com/2454/pyu-r-int-thick-7-2454224.pdf?src-supplier=Digikey; Supplier Part Number 1: 4595138
R?#30 = RES 100K OHM 0603 - L: Res Thick Film 0603 100K Ohm 5% 1/10W ±200ppm/°C Molded SMD Paper T/R; Manufacturer: Stackpole Electronics; Manufacturer Part Number: RMCF0603JT100K; Voltage Rating: 75V; Supplier 1: Avnet; RoHS: Yes; Category: Chip SMD Resistors; Stock 1: 15000; Pricing 1: 5000=0,00122, 10000=0,00121, 20000=0,00119, 30000=0,00117, 40000=0,00115 (USD); ComponentLink1URL: https://datasheet.ciiva.com/15193/getdatasheetpartid-359906-15193499.pdf?src-supplier=Verical; ComponentLink1Description: https://datasheet.ciiva.com/15193/getdatasheetpartid-359906-15193499.pdf?src-supplier=Verical; Supplier Part Number 1: RMCF0603JT100K
R?#31 = RES 10K OHM 0603: SMD Chip Resistor, 10 kOhm, ï¿½ 1%, 100 mW, 0603 [1608 Metric], Thick Film, General Purpose; Manufacturer: Yageo; Manufacturer Part Number: RC0603FR-0710KL; Temperature Coefficient: 100ppm/°C; Voltage Rating (DC): 50V; Power Rating: 100mW; Voltage Rating: 75V; Resistance: 10kR; Supplier 1: Digi-Key; RoHS: Yes; Category: Chip SMD Resistors; Stock 1: 43901522; Pricing 1: 1=0,10000, 10=0,02200, 100=0,00890, 1000=0,00402, 2500=0,00349 (USD); Case/Package: 0603; Number of Pins: 2; Case Code (Imperial): 0603; Case Code (Metric): 1608; Weight: 7.1E-05oz; Size Code: 0603; Min Operating Temperature: -55°C; Max Operating Temperature: 155°C; Tolerance: 1%; Resistor Type: Thick Film; Packaging: Tape and Reel; Termination: SMD/SMT; Features: Moisture Resistant; Series: RC; Max Power Dissipation: 100mW; Number of Terminations: 2; Resistance Tolerance: 1%; Construction: Rectangular; Length: 1.6mm; Width: 0.8mm; Height: 0.45mm; Depth: 0.8mm; Lead Pitch: 0.3mm; REACH SVHC: Unknown; Lead Free: Lead Free; Military Standard: Not; RoHS Compliant: Yes; ComponentLink1URL: https://datasheet.ciiva.com/7660/38590-7660789.pdf?src-supplier=Element14; ComponentLink1Description: https://datasheet.ciiva.com/7660/38590-7660789.pdf?src-supplier=Element14; ComponentLink2URL: https://datasheet.ciiva.com/7983/443971-7983596.pdf?src-supplier=Element14; ComponentLink2Description: https://datasheet.ciiva.com/7983/443971-7983596.pdf?src-supplier=Element14; ComponentLink3URL: https://datasheet.ciiva.com/22747/443971-22747519.pdf?src-supplier=Element14; ComponentLink3Description: https://datasheet.ciiva.com/22747/443971-22747519.pdf?src-supplier=Element14; ComponentLink4URL: https://datasheet.ciiva.com/46440/1868787-46440891.pdf?src-supplier=Element14; ComponentLink4Description: https://datasheet.ciiva.com/46440/1868787-46440891.pdf?src-supplier=Element14; ComponentLink5URL: https://datasheet.ciiva.com/7746/1738695-7746239.pdf?src-supplier=Element14; ComponentLink5Description: https://datasheet.ciiva.com/7746/1738695-7746239.pdf?src-supplier=Element14; ComponentLink6URL: https://datasheet.ciiva.com/15189/getdatasheetpartid-409289-15189591.pdf?src-supplier=Verical; ComponentLink6Description: https://datasheet.ciiva.com/15189/getdatasheetpartid-409289-15189591.pdf?src-supplier=Verical; Supplier Part Number 1: 311-10.0KHRCT-ND; Supplier 2: Digikey; Stock 2: 3432908; Pricing 2: 1=0,1, 10=0,009, 100=0,0071, 1000=0,00612, 2500=0,00461 (USD); Reach SVHC Compliant: No; Supplier Part Number 2: 311-10.0KHRDKR-ND
R?#32-R?#34 = RES 1M OHM 0603 - L: Res Thick Film 0603 1M Ohm 5% 1/10W ±200ppm/°C Molded SMD SMD Paper T/R; Manufacturer: Vishay Dale; Manufacturer Part Number: CRCW06031M00JNEA; Resistance: 1MR; Power Rating: 100mW; Voltage Rating: 75V; Supplier 1: Arrow Electronics; RoHS: Yes; Category: Chip SMD Resistors; Stock 1: 960000; Pricing 1: 5000=0,0028 (USD); Case/Package: 0603; Number of Pins: 2; Weight: 7.1E-05oz; Case Code (Imperial): 0603; Case Code (Metric): 1608; Contact Plating: Tin; Size Code: 0603; Min Operating Temperature: -55°C; Max Operating Temperature: 155°C; Tolerance: 5%; Packaging: Tape and Reel; Package Quantity: 5000; Termination: SMD/SMT; Resistor Type: Thick Film; Number of Terminations: 2; Temperature Coefficient: 200ppm/°C; Max Power Dissipation: 100mW; Features: Automotive AEC-Q200; Series: CRCW; Construction: Rectangular; Resistance Tolerance: 5%; Length: 1.55mm; Width: 0.85mm; Height: 0.45mm; Depth: 0.85mm; Ratings: AEC-Q200; Radiation Hardening: No; Lead Free: 5697LeadFree; Military Standard: Not; RoHS Compliant: Yes; Reach SVHC Compliant: Unknown; ComponentLink1URL: https://datasheet.ciiva.com/2462/dcrcwe3-2462062.pdf?src-supplier=Digikey; ComponentLink1Description: https://datasheet.ciiva.com/2462/dcrcwe3-2462062.pdf?src-supplier=Digikey; ComponentLink2URL: https://datasheet.ciiva.com/2462/dcrcwe3-2462063.pdf?src-supplier=Digikey; ComponentLink2Description: https://datasheet.ciiva.com/2462/dcrcwe3-2462063.pdf?src-supplier=Digikey; ComponentLink3URL: https://datasheet.ciiva.com/2462/dcrcwe3-2462061.pdf?src-supplier=Digikey; ComponentLink3Description: https://datasheet.ciiva.com/2462/dcrcwe3-2462061.pdf?src-supplier=Digikey; ComponentLink4URL: https://datasheet.ciiva.com/3257/dcrcwe3-3257206.pdf?src-supplier=Avnet; ComponentLink4Description: https://datasheet.ciiva.com/3257/dcrcwe3-3257206.pdf?src-supplier=Avnet; ComponentLink5URL: https://datasheet.ciiva.com/16351/dcrcwe3-16351110.pdf?src-supplier=Future+Electronics; ComponentLink5Description: https://datasheet.ciiva.com/16351/dcrcwe3-16351110.pdf?src-supplier=Future+Electronics; Supplier Part Number 1: CRCW06031M00JNEA
R?#36 = RES 100 OHM 0805: Res Thick Film 0805 100 Ohm 1% 0.5W(1/2W) +/-100ppm/C Pad SMD Automotive T/R; Manufacturer: Vishay Dale; Manufacturer Part Number: CRCW0805100RFKEAHP; Voltage Rating (DC): 150V; Supplier 1: Mouser; RoHS: Yes; Category: Chip SMD Resistors; Stock 1: 108057; Pricing 1: 1=0,18, 10=0,061, 50=0,061, 100=0,052, 1000=0,033, 10000=0,022 (USD); Lead Free: 5697LeadFree; RoHS Compliant: 5897YesNo; Supplier Part Number 1: 71-CRCW0805100RFKEAH
R?#37 = RES 1M OHM 0603: Chip Resistor Automotive Grade Thick Film 0603 1MOhm 1% Paper T/R; Manufacturer: Yageo; Manufacturer Part Number: AC0603FR-101ML; Resistance: 1MR; Power Rating: 100mW; Voltage Rating: 75V; Supplier 1: Digikey; RoHS: Yes; Category: Chip SMD Resistors; Stock 1: 15550; Pricing 1: 1=0,1, 10=0,008, 100=0,0061, 1000=0,00561, 2500=0,0051, 5000=0,00497 (USD); Case/Package: 0603; Min Operating Temperature: -55°C; Max Operating Temperature: 155°C; Tolerance: 1%; Packaging: 10Packaging; Height: 550um; RoHS Compliant: Yes; ComponentLink1URL: https://datasheet.octopart.com/AC0603FR-101ML-Yageo-datasheet-178509465.pdf?src-supplier=Newark; ComponentLink1Description: https://datasheet.octopart.com/AC0603FR-101ML-Yageo-datasheet-178509465.pdf?src-supplier=Newark; ComponentLink2URL: https://datasheet.octopart.com/AC0603FR-101ML-Yageo-datasheet-178509465.pdf?src-supplier=Farnell; ComponentLink2Description: https://datasheet.octopart.com/AC0603FR-101ML-Yageo-datasheet-178509465.pdf?src-supplier=Farnell; ComponentLink3URL: https://datasheet.octopart.com/AC0603FR-101ML-Yageo-datasheet-178509465.pdf?src-supplier=Element14; ComponentLink3Description: https://datasheet.octopart.com/AC0603FR-101ML-Yageo-datasheet-178509465.pdf?src-supplier=Element14; Supplier Part Number 1: 13-AC0603FR-101MLCT-ND
U?#6 = AD8232: Instrumentation Amplifier 20-Pin LFCSP EP T/R; Manufacturer: Analog Devices; Common Mode Rejection Ratio: 80dB; Input Offset Voltage (Vos): 3mV; Operating Supply Current: 170uA; Input Bias Current: 50pA; Power Supply Rejection Ratio (PSRR): 90dB; Operating Supply Voltage: 3.5V; Supplier 1: Arrow Electronics; Manufacturer Part Number: AD8232ACPZ-RL; RoHS: Yes; Category: Amplifiers - Op Amps, Buffer, Instrumentation; Pricing 1: 5000=3,583, 10000=3,568, 15000=3,552, 20000=3,537, 25000=3,522, 30000=3,506, 40000=3,49, 50000=3,474, 100000=3,458 (USD); Mount: Surface Mount; Case/Package: LFCSP EP; Number of Pins: 20; Contact Plating: Tin,Matte; Min Operating Temperature: -40°C; Max Operating Temperature: 85°C; Packaging: Tape and Reel; Package Quantity: 5000; Supply Current: 170uA; Series: -; Lead Free: Contains Lead; RoHS Compliant: Yes; ComponentLink1URL: https://datasheet.ciiva.com/8082/ad8232-8082010.pdf?src-supplier=Avnet; ComponentLink1Description: https://datasheet.ciiva.com/8082/ad8232-8082010.pdf?src-supplier=Avnet; ComponentLink2URL: https://datasheet.ciiva.com/6579/ad8232-6579404.pdf?src-supplier=Digikey; ComponentLink2Description: https://datasheet.ciiva.com/6579/ad8232-6579404.pdf?src-supplier=Digikey; Supplier Part Number 1: AD8232ACPZ-RL
U?#7 = TPS63021DSJR: High Efficiency Single Inductor Buck-Boost Converter with 4A Switch 14-VSON -40 to 125; Manufacturer: Texas Instruments; Efficiency: 96%; Number of Outputs: 1; Output Voltage: 3.3V; Max Output Current: 3A; Min Input Voltage: 1.8V; Max Input Voltage: 5.5V; Switching Frequency: 2.4MHz; Synchronous Rectifier: Yes; Quiescent Current: 50uA; Output Type: Fixed; Supplier 1: Digikey; Manufacturer Part Number: TPS63021DSJR; RoHS: Yes; Category: Voltage Regulators - Switching; Stock 1: 6023; Pricing 1: 1=2,63, 10=1,96, 25=1,7924, 100=1,6078, 250=1,51976, 500=1,46668, 1000=1,42301 (USD); Mount: Surface Mount; Case/Package: VSON; Number of Pins: 14; Min Operating Temperature: -40°C; Max Operating Temperature: 85°C; Package Quantity: 1; Packaging: Cut Tape; Output Current: 3A; Operating Supply Voltage: 5.5V; Series: -; Reach SVHC Compliant: No; Lead Free: Lead Free; RoHS Compliant: Yes; ComponentLink1URL: https://datasheet.ciiva.com/2026/tps63021-2026362.pdf?src-supplier=Digikey; ComponentLink1Description: https://datasheet.ciiva.com/2026/tps63021-2026362.pdf?src-supplier=Digikey; ComponentLink2URL: https://datasheet.ciiva.com/2026/tps63021-2026361.pdf?src-supplier=Digikey; ComponentLink2Description: https://datasheet.ciiva.com/2026/tps63021-2026361.pdf?src-supplier=Digikey; ComponentLink3URL: https://datasheet.ciiva.com/2026/tps63021-2026363.pdf?src-supplier=Digikey; ComponentLink3Description: https://datasheet.ciiva.com/2026/tps63021-2026363.pdf?src-supplier=Digikey; ComponentLink4URL: https://datasheet.ciiva.com/3221/tps63020-3221510.pdf?src-supplier=Avnet; ComponentLink4Description: https://datasheet.ciiva.com/3221/tps63020-3221510.pdf?src-supplier=Avnet; Supplier Part Number 1: 296-27259-1-ND

## Nets that join several sheets
+3V3: Microcontroller (18 pins), AD8232 (16 pins)
GND: Microcontroller (41 pins), AD8232 (17 pins)
AD8232_OUT: Microcontroller (U?#1.11), AD8232 (C?#23.1 R?#32.2 R?#35.2 U?#6.10)
B+: Microcontroller (C?#15.2 J?#3.1 R?#10.1 U?#5.5), AD8232 (J?#9.1)
B-: Microcontroller (5 pins), AD8232 (J?#9.2)
PG: Microcontroller (U?#1.18), AD8232 (R?#37.1 U?#7.14)